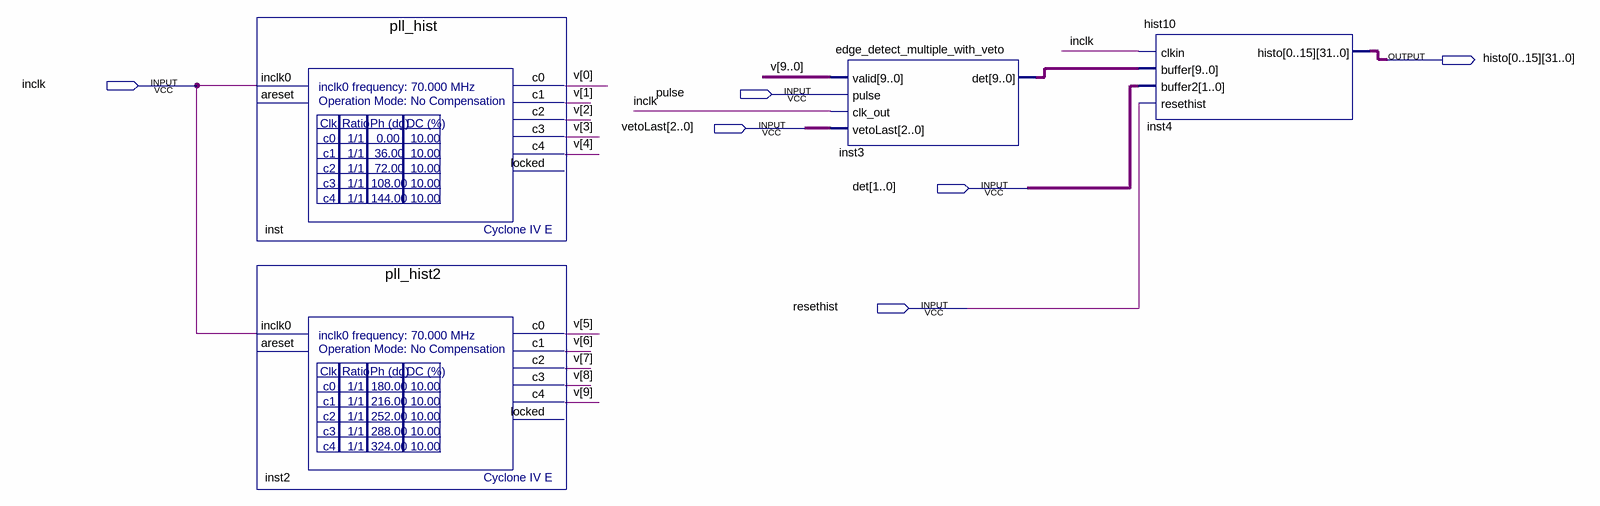
[diagram p0: schematic sheet]
// Quartus schematic makeHistogram.bdf as structural Verilog: 4 symbols, 6 pins
module makeHistogram (
  input  inclk,
  input  pulse,
  input  [2:0] vetoLast,
  input  [1:0] det,
  input  resethist,
  output [31:0] histo_0,
  output [31:0] histo_1,
  output [31:0] histo_2,
  output [31:0] histo_3,
  output [31:0] histo_4,
  output [31:0] histo_5,
  output [31:0] histo_6,
  output [31:0] histo_7,
  output [31:0] histo_8,
  output [31:0] histo_9,
  output [31:0] histo_10,
  output [31:0] histo_11,
  output [31:0] histo_12,
  output [31:0] histo_13,
  output [31:0] histo_14,
  output [31:0] histo_15
);

  wire [9:0] inst3_det, v;

  pll_hist inst (.inclk0(inclk), .c0(v[0]), .c1(v[1]), .c2(v[2]), .c3(v[3]), .c4(v[4]));  // open: areset, locked
  pll_hist2 inst2 (.inclk0(inclk), .c0(v[5]), .c1(v[6]), .c2(v[7]), .c3(v[8]), .c4(v[9]));  // open: areset, locked
  edge_detect_multiple_with_veto inst3 (
    .valid(v), .pulse(pulse), .clk_out(inclk), .vetoLast(vetoLast), .det(inst3_det));
  hist10 inst4 (
    .clkin(inclk), .buffer(inst3_det), .buffer2(det), .resethist(resethist),
    .histo({histo_0, histo_1, histo_2, histo_3, histo_4, histo_5, histo_6, histo_7, histo_8, histo_9, histo_10, histo_11, histo_12, histo_13, histo_14, histo_15}));
endmodule
